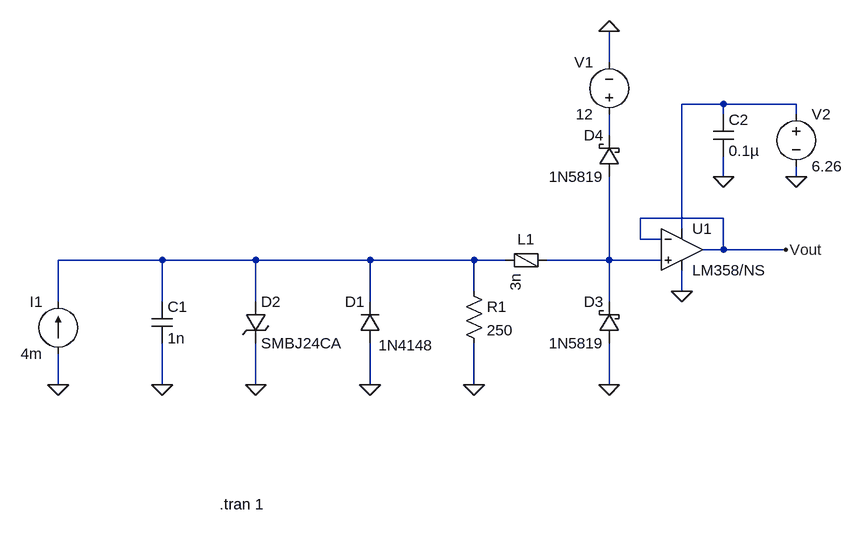
[diagram p0: schematic V_C_Converter.asc]
V_C_Converter.asc, the LTspice schematic file:
Version 4
SHEET 1 880 680
WIRE 272 -208 272 -256
WIRE 448 -144 384 -144
WIRE 560 -144 448 -144
WIRE 448 -128 448 -144
WIRE 560 -128 560 -144
WIRE 272 -96 272 -128
WIRE 448 -32 448 -64
WIRE 560 -32 560 -48
WIRE 448 32 320 32
WIRE 384 48 384 -144
WIRE 320 64 320 32
WIRE 352 64 320 64
WIRE 448 80 448 32
WIRE 448 80 416 80
WIRE 544 80 448 80
WIRE -416 96 -576 96
WIRE -272 96 -416 96
WIRE -96 96 -272 96
WIRE 64 96 -96 96
WIRE 112 96 64 96
WIRE 272 96 272 -32
WIRE 272 96 176 96
WIRE 352 96 272 96
WIRE 64 144 64 96
WIRE 384 144 384 112
WIRE -576 160 -576 96
WIRE -416 160 -416 96
WIRE -272 160 -272 96
WIRE -96 160 -96 96
WIRE 272 160 272 96
WIRE -576 288 -576 240
WIRE -416 288 -416 224
WIRE -272 288 -272 224
WIRE -96 288 -96 224
WIRE 64 288 64 224
WIRE 272 288 272 224
FLAG 384 144 0
FLAG 272 288 0
FLAG -96 288 0
FLAG -272 288 0
FLAG -416 288 0
FLAG 272 -256 0
FLAG 560 -32 0
FLAG -576 288 0
FLAG 448 -32 0
FLAG 544 80 Vout
FLAG 64 288 0
SYMBOL FerriteBead 144 96 R90
WINDOW 0 -16 0 VBottom 2
SYMATTR InstName L1
SYMATTR Value 3n
SYMATTR SpiceLine Ipk=2 Rser=0.064 Rpar=620 Cpar=1.1p mfg="Würth Elektronik" pn="782763621 WE-CBA 1206"
SYMBOL diode -80 224 R180
WINDOW 0 24 64 Left 2
WINDOW 3 -82 -3 Left 2
SYMATTR InstName D1
SYMATTR Value 1N4148
SYMBOL TVSdiode -288 160 R0
SYMATTR InstName D2
SYMATTR Value SMBJ24CA
SYMBOL cap -432 160 R0
SYMATTR InstName C1
SYMATTR Value 1n
SYMBOL schottky 288 224 R180
WINDOW 0 24 64 Left 2
WINDOW 3 24 0 Left 2
SYMATTR InstName D3
SYMATTR Value 1N5819
SYMATTR Description Diode
SYMATTR Type diode
SYMBOL schottky 288 -32 R180
WINDOW 0 24 64 Left 2
WINDOW 3 24 0 Left 2
SYMATTR InstName D4
SYMATTR Value 1N5819
SYMATTR Description Diode
SYMATTR Type diode
SYMBOL EXTRA\\ExtraOpamps\\LM358_NS 384 80 R0
SYMATTR InstName U1
SYMBOL voltage 272 -112 R180
WINDOW 0 24 96 Left 2
WINDOW 3 24 16 Left 2
WINDOW 123 0 0 Left 0
WINDOW 39 0 0 Left 0
SYMATTR InstName V1
SYMATTR Value 12
SYMBOL voltage 560 -144 R0
WINDOW 123 0 0 Left 0
WINDOW 39 0 0 Left 0
SYMATTR InstName V2
SYMATTR Value 6.26
SYMBOL cap 432 -128 R0
SYMATTR InstName C2
SYMATTR Value 0.1µ
SYMBOL current -576 240 R180
WINDOW 0 24 80 Left 2
WINDOW 3 24 0 Left 2
WINDOW 123 0 0 Left 0
WINDOW 39 0 0 Left 0
SYMATTR InstName I1
SYMATTR Value 4m
SYMBOL res 48 128 R0
SYMATTR InstName R1
SYMATTR Value 250
TEXT -328 472 Left 2 !.tran 1

The netlist it stands for:
* V_C_Converter.asc
L1 N004 N003 3n Ipk=2 Rser=0.064 Rpar=620 Cpar=1.1p mfg="Würth Elektronik" pn="782763621 WE-CBA 1206"
D1 0 N003 1N4148
D2 N003 0 SMBJ24CA
C1 N003 0 1n
D3 0 N004 1N5819
D4 N004 N002 1N5819
XU1 N004 Vout N001 0 Vout LM358/NS  ; pins In+ In- V+ V- OUT
V1 N002 0 12
V2 N001 0 6.26
C2 N001 0 0.1µ
I1 0 N003 4m
R1 N003 0 250
.model D D
.lib standard.dio
.tran 1
.backanno
.end